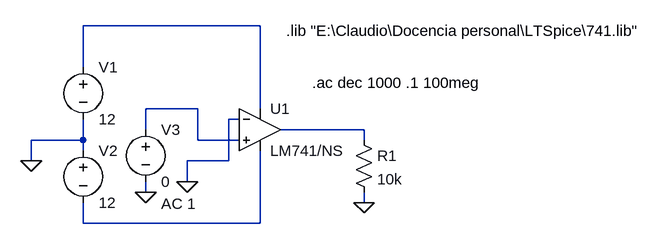
[diagram p0: schematic 741biblioext.asc]
741biblioext.asc, the LTspice schematic file:
Version 4
SHEET 1 1112 680
WIRE 192 32 -80 32
WIRE -80 96 -80 32
WIRE 96 160 16 160
WIRE 192 160 192 32
WIRE 160 176 144 176
WIRE 16 192 16 160
WIRE 352 192 224 192
WIRE -80 208 -80 176
WIRE -80 208 -160 208
WIRE 96 208 96 160
WIRE 160 208 96 208
WIRE 352 208 352 192
WIRE -80 224 -80 208
WIRE -160 240 -160 208
WIRE 144 240 144 176
WIRE 144 240 80 240
WIRE 80 272 80 240
WIRE 16 288 16 272
WIRE 352 304 352 288
WIRE -80 336 -80 304
WIRE 192 336 192 224
WIRE 192 336 -80 336
FLAG -160 240 0
FLAG 80 272 0
FLAG 16 288 0
FLAG 352 304 0
SYMBOL voltage -80 80 R0
WINDOW 123 0 0 Left 2
WINDOW 39 0 0 Left 2
SYMATTR InstName V1
SYMATTR Value 12
SYMBOL voltage -80 208 R0
WINDOW 123 0 0 Left 2
WINDOW 39 0 0 Left 2
SYMATTR InstName V2
SYMATTR Value 12
SYMBOL voltage 16 176 R0
WINDOW 123 24 130 Left 2
WINDOW 39 0 0 Left 2
SYMATTR Value2 AC 1
SYMATTR InstName V3
SYMATTR Value 0
SYMBOL res 336 192 R0
SYMATTR InstName R1
SYMATTR Value 10k
SYMBOL Opamps\\opamp2 192 128 R0
SYMATTR InstName U1
SYMATTR Value LM741/NS
TEXT 272 120 Left 2 !.ac dec 1000 .1 100meg
TEXT 232 40 Left 2 !.lib "E:\\Claudio\\Docencia personal\\LTSpice\\741.lib"

The netlist it stands for:
* 741biblioext.asc
V1 N001 0 12
V2 0 N004 12
V3 N002 0 0 AC 1
R1 N003 0 10k
XU1 N002 0 N001 N004 N003 LM741/NS  ; pins In+ In- V+ V- OUT
.ac dec 1000 .1 100meg
.lib "E:\Claudio\Docencia personal\LTSpice\741.lib"
.backanno
.end